# EAGLE schematic Ex Build System Lights (EAGLE 7.5.0)
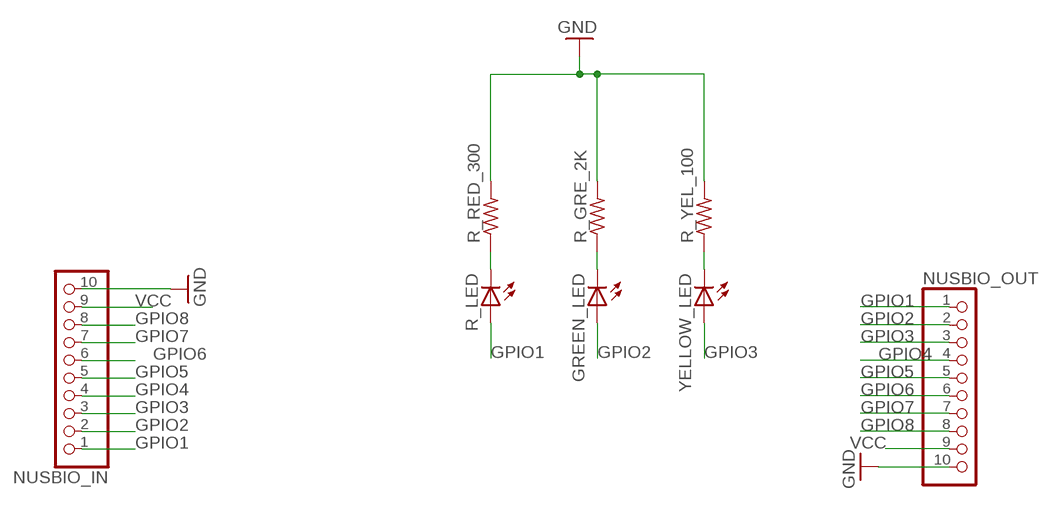
[diagram p0: schematic, sheet 1]

## Parts
GREEN_LED  LED5MM  [LED5MM]
NUSBIO_IN  PINHD-1X10  [1X10-BIG]
NUSBIO_OUT  PINHD-1X10  [1X10-BIG]
R_GRE_2K  R-US_R0805  [R0805]
R_LED  LED5MM  [LED5MM]
R_RED_300  R-US_R0805  [R0805]
R_YEL_100  R-US_R0805  [R0805]
YELLOW_LED  LED5MM  [LED5MM]

## Nets
GND: NUSBIO_IN.10 NUSBIO_OUT.10 R_GRE_2K.2 R_RED_300.2 R_YEL_100.2
GPIO1: NUSBIO_IN.1 NUSBIO_OUT.1 R_LED.A
GPIO2: GREEN_LED.A NUSBIO_IN.2 NUSBIO_OUT.2
GPIO3: NUSBIO_IN.3 NUSBIO_OUT.3 YELLOW_LED.A
GPIO4: NUSBIO_IN.4 NUSBIO_OUT.4
GPIO5: NUSBIO_IN.5 NUSBIO_OUT.5
GPIO6: NUSBIO_IN.6 NUSBIO_OUT.6
GPIO7: NUSBIO_IN.7 NUSBIO_OUT.7
GPIO8: NUSBIO_IN.8 NUSBIO_OUT.8
N$1: R_LED.K(C) R_RED_300.1
N$2: GREEN_LED.K(C) R_GRE_2K.1
N$3: R_YEL_100.1 YELLOW_LED.K(C)
VCC: NUSBIO_IN.9 NUSBIO_OUT.9

## Library data of the parts
GREEN_LED R_LED YELLOW_LED = adafruit:LED: LED OSRAM: - CHIPLED LG R971, LG N971, LY N971, LG Q971, LY Q971, LO R971, LY R971 LH N974, LH R974 LS Q976, LO Q976, LY Q976 LO Q996 - Hyper CHIPLED LW Q18S LB Q993, LB Q99A, LB R99A - SideLED LS A670, LO A670, LY A670, LG A670, LP A670 LB A673, LV A673, LT A673, LW A673 LH A674 LY A675 LS A676, LA A676, LO A676, LY A676, LW A676 LS A679, LY A679, LG A679 - Hyper Micro SIDELED® LS Y876, LA Y876, LO Y876, LY Y876 LT Y87S - SmartLED LW L88C, LW L88S LB L89C, LB L89S, LG L890 LS L89K, LO L89K, LY L89K LS L896, LA L896, LO L896, LY L896 - TOPLED LS T670, LO T670, LY T670, LG T670, LP T670 LSG T670, LSP T670, LSY T670, LOP T670, LYG T670 LG T671, LOG T671, LSG T671 LB T673, LV T673, LT T673, LW T673 LH T674 LS T676, LA T676, LO T676, LY T676, LB T676, LH T676, LSB T676, LW T676 LB T67C, LV T67C, LT T67C, LS T67K, LO T67K, LY T67K, LW E67C LS E67B, LA E67B, LO E67B, LY E67B, LB E67C, LV E67C, LT E67C LW T67C LS T679, LY T679, LG T679 LS T770, LO T770, LY T770, LG T770, LP T770 LB T773, LV T773, LT T773, LW T773 LH T774 LS E675, LA E675, LY E675, LS T675 LS T776, LA T776, LO T776, LY T776, LB T776 LHGB T686 LT T68C, LB T68C - Hyper Mini TOPLED® LB M676 - Mini TOPLED Santana® LG M470 LS M47K, LO M47K, LY M47K Source: http://www.osram.convergy.de/
NUSBIO_IN NUSBIO_OUT = adafruit:PINHD-1X10: Pin header 1x10 0.1" spacing With round pins
R_GRE_2K R_RED_300 R_YEL_100 = adafruit:R-US_: RESISTOR, American symbol